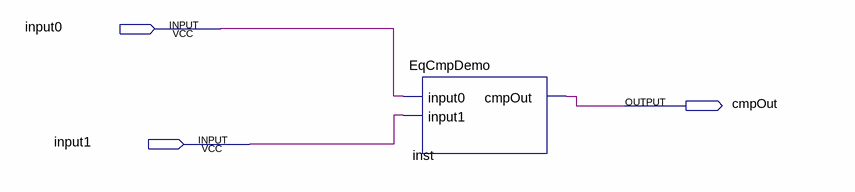
[diagram p0: schematic sheet]
// Quartus schematic EqCmpDemo2.bdf as structural Verilog: 1 symbols, 3 pins
module EqCmpDemo2 (
  input  input0,
  input  input1,
  output cmpOut
);

  EqCmpDemo inst (.input0(input0), .input1(input1), .cmpOut(cmpOut));
endmodule
